# Altium schematic sheet Peripherals.SchDoc: Peripherals
size A3; CompanyName: Green Team Twente; Organization: Green Team Twente; Revision: V1.1; SheetNumber: 7; SheetTotal: 10; Team: 2024; Subsystem: Embedded Systems
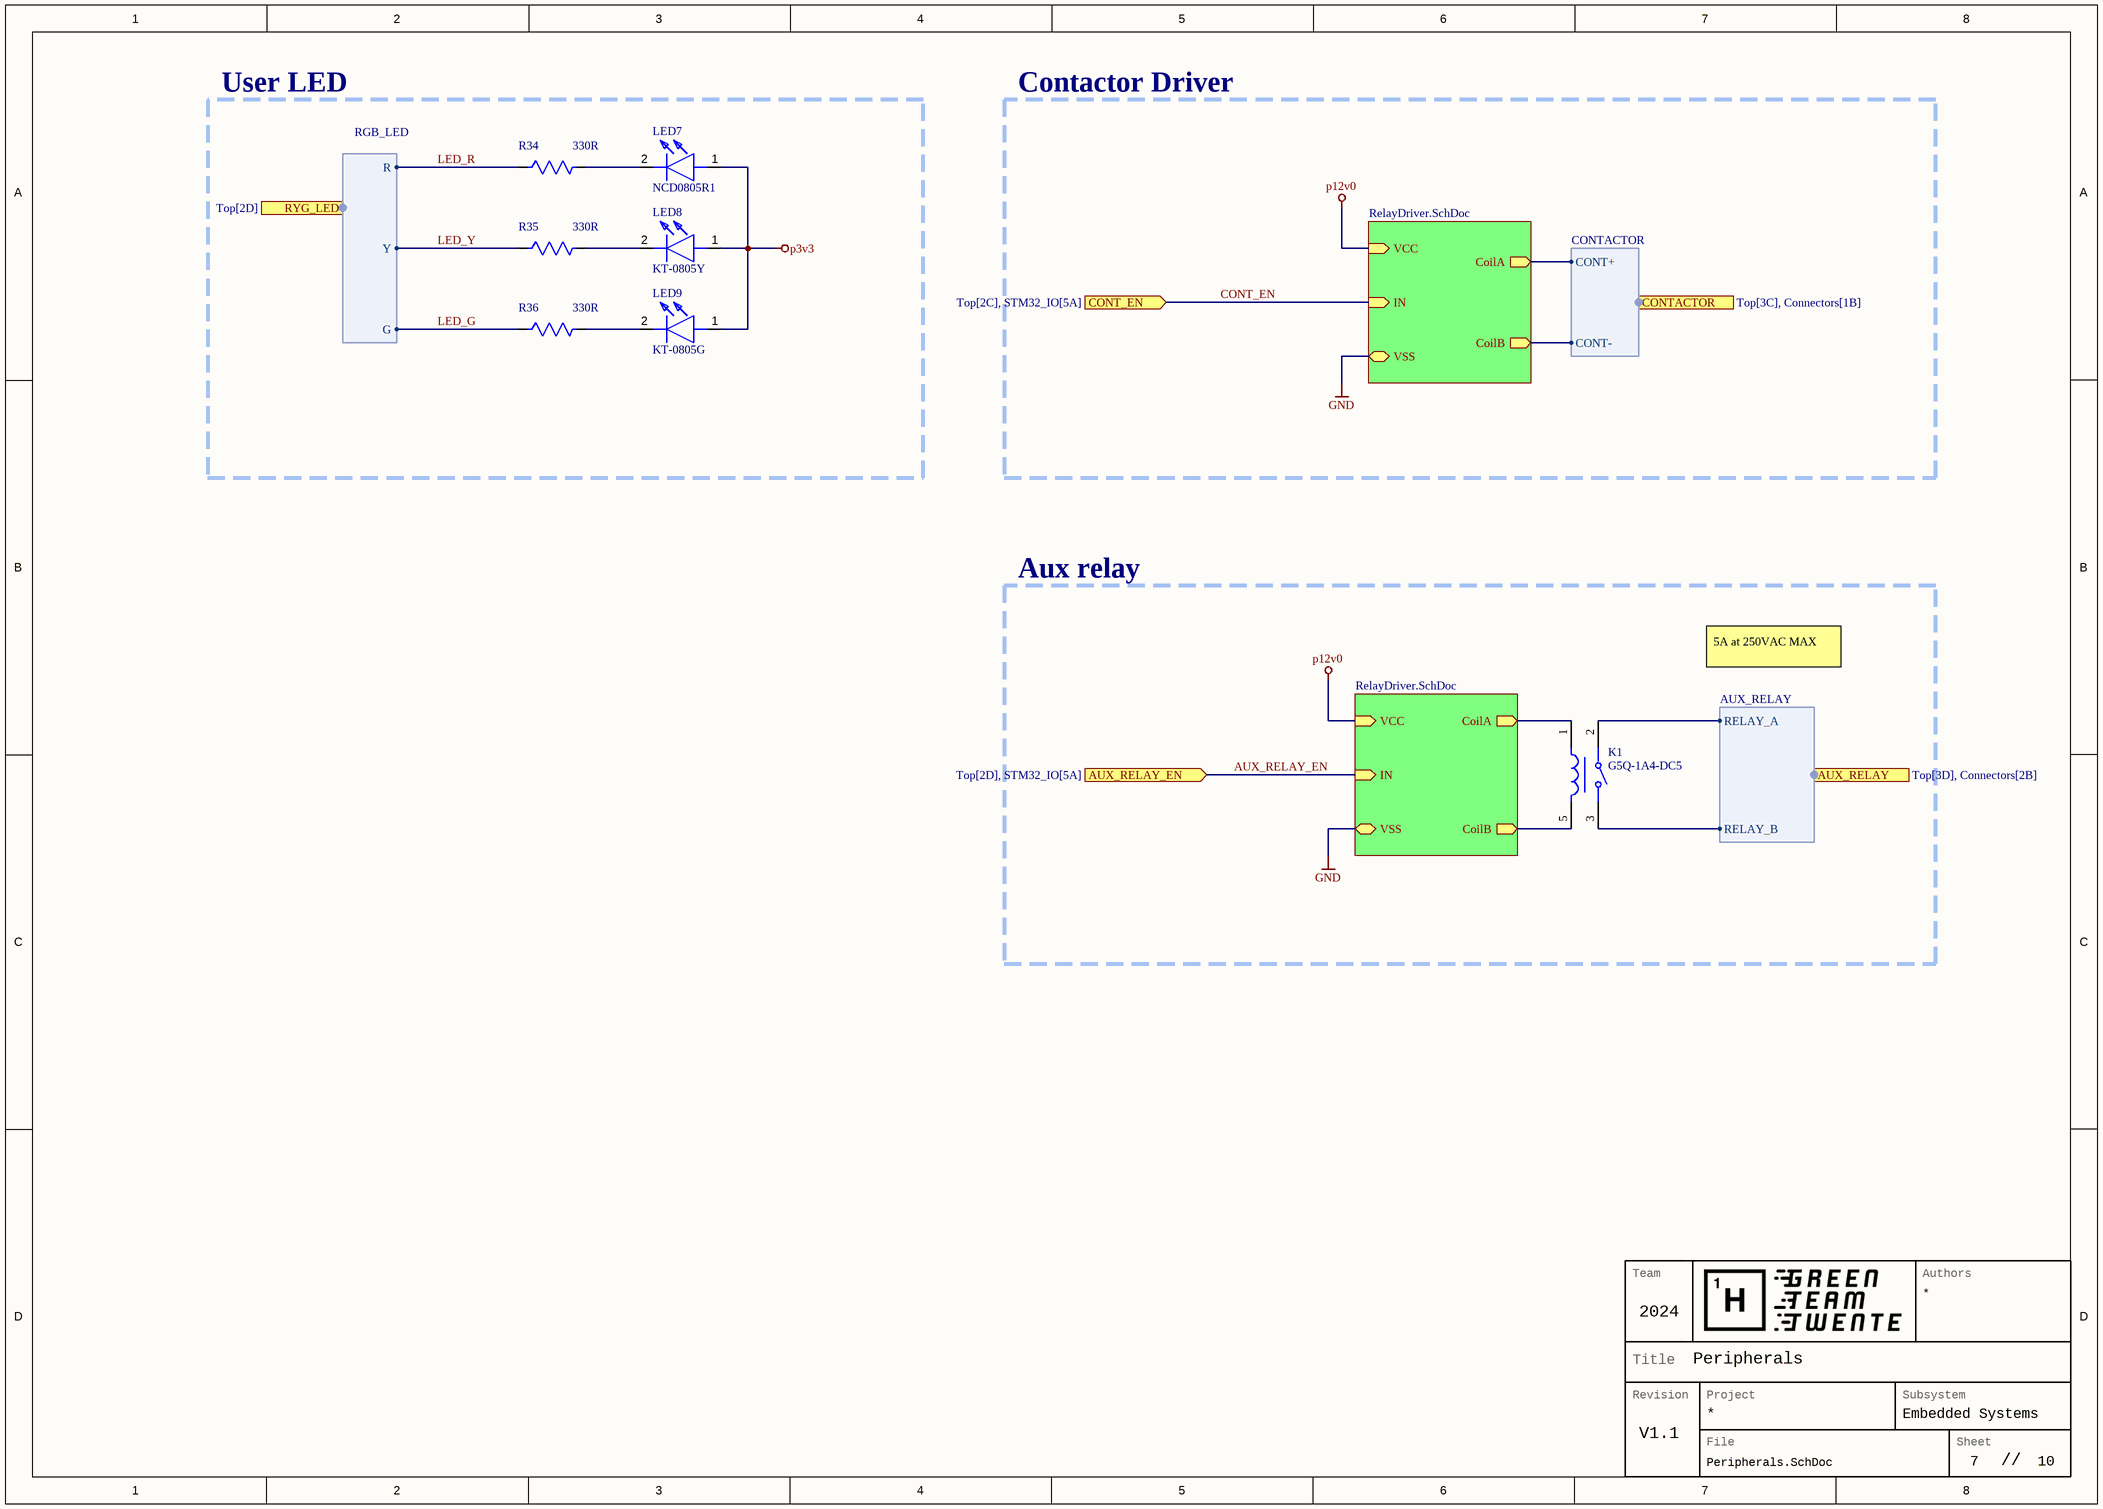
[diagram p0: Peripherals.SchDoc]

## Parts
K1  G5Q-1A4-DC5  [FP-G5Q-1A4-DC5-MFG]
LED7  NCD0805R1  [KT0805G]
LED8  KT-0805Y  [KT0805G]
LED9  KT-0805G  [KT0805G]
R34  value 330R  [RES_SM0603_YAGEORC_N]  (hidden comment: RES 0603 330R 1%)
R35  value 330R  [RES_SM0603_YAGEORC_N]  (hidden comment: RES 0603 330R 1%)
R36  value 330R  [RES_SM0603_YAGEORC_N]  (hidden comment: RES 0603 330R 1%)

## Blocks framed on the sheet
User LED: LED7-LED9 R34-R36
Aux relay: K1

## Sub-sheets
AuxRelay = RelayDriver.SchDoc: IN (in), VCC (in), VSS (bidir), CoilA (out), CoilB (out)
ContactorDriver = RelayDriver.SchDoc: IN (in), VCC (in), VSS (bidir), CoilA (out), CoilB (out)

## Ports
AUX_RELAY (out, harness AUX_RELAY, see Top[3D], Connectors[2B]), AUX_RELAY_EN (in, see Top[2D], STM32_IO[5A]), CONT_EN (in, see Top[2C], STM32_IO[5A]), CONTACTOR (out, harness CONTACTOR, see Top[3C], Connectors[1B]), RYG_LED (out, harness RGB_LED, see Top[2D])

## Harnesses
RGB_LED: G, Y, R
CONTACTOR: CONT+, CONT-
AUX_RELAY: RELAY_A, RELAY_B

## Nets
GND: sheet ContactorDriver/VSS, sheet AuxRelay/VSS
p3v3: LED7.1(A) LED8.1(A) LED9.1(A)
p12v0: sheet ContactorDriver/VCC, sheet AuxRelay/VCC
AUX_RELAY_EN: port AUX_RELAY_EN, sheet AuxRelay/IN
CONT_EN: port CONT_EN, sheet ContactorDriver/IN
LED_G: R36.1 ; port RYG_LED.G
LED_R: R34.1 ; port RYG_LED.R
LED_Y: R35.1 ; port RYG_LED.Y
NetK1_1: K1.1 ; sheet AuxRelay/CoilA
NetK1_2: K1.2 ; port AUX_RELAY.RELAY_A
NetK1_3: K1.3 ; port AUX_RELAY.RELAY_B
NetK1_5: K1.5 ; sheet AuxRelay/CoilB
NetLED7_2: LED7.2(K) R34.2
NetLED8_2: LED8.2(K) R35.2
NetLED9_2: LED9.2(K) R36.2
(unnamed): sheet ContactorDriver/CoilA, port CONTACTOR.CONT+
(unnamed): sheet ContactorDriver/CoilB, port CONTACTOR.CONT-

## Notes on the sheet
- Contactor Driver
- 5A at 250VAC MAX
- Team
- Authors
- Revision
- Title
- Project
- Subsystem
- File
- Sheet
- //

## Library data of the parts
K1 = CMP-08822-000148-1: RELAY GEN PURPOSE SPST 10A 5V; Relay Type: General Purpose; Operate Time: 10ms; Approvals: UL; Voltage Rating (AC): 277V; Max Voltage Rating (DC): 30V; Power Consumption: 2mW; Coil Current: 40mA; Release Time: 5ms; Coil Type: Non-Latching; Coil Power: 200mW; Coil Resistance: 125R; Max Current Rating: 10A; Number of Pins: 4; Termination: PC Pin; Packaging: Bulk; Length: 20.3mm; Radiation Hardening: No; Throw Configuration: SPST; Mount: Through Hole; Max Voltage Rating (AC): 277V; Contact Material: Silver; Min Operating Temperature: -40°C; Current Rating: 10A; Max Operating Temperature: 105°C; Contact Current Rating: 10A; Package Quantity: 400; Series: G5Q; Coil Voltage (DC): 5V; Depth: 10.3mm; Weight: 6.5g
LED7-LED9 = KT-0805G: LED; Manufacturer_Name: Hubei KENTO Elec; Datasheet Link: https://jlcpcb.com/api/file/downloadByFileSystemAccessId/8639582106239348736; Height: 0.95mm; Manufacturer_Part_Number: KT-0805G
  LED7: JLCPCB Part #: C84256
  LED8: JLCPCB Part #: C2296
  LED9: JLCPCB Part #: C2297
R34-R36 = CMP-009-00206-3: GTT Standard 0603 Resistor; Voltage Rating: 50V; Power: 62.5mW; Case/Package: 0603; Tolerance: 1%; Mounting Technology: SMD; JLCPCB Part #: C23138